# EAGLE design 555 (EAGLE 9.6.2)
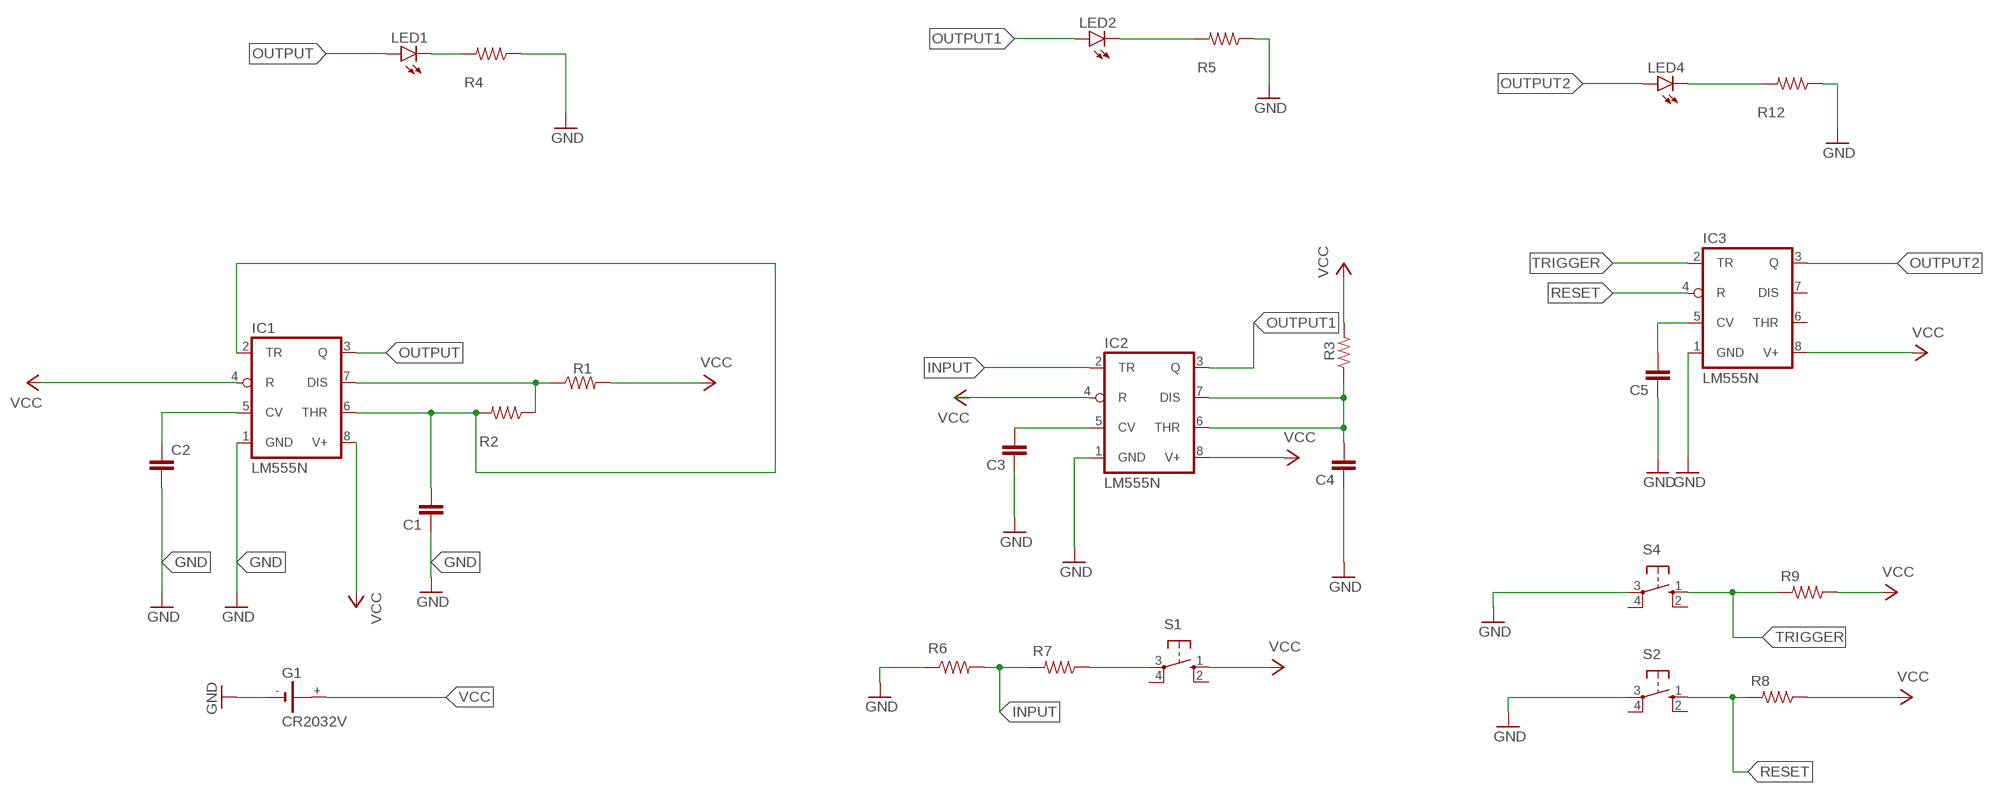
[diagram p0: schematic, sheet 1]

## Parts
C1  C-EU025-025X050  [C025-025X050]
C2  C-EU025-025X050  [C025-025X050]
C3  C-EU025-025X050  [C025-025X050]
C4  C-EU025-025X050  [C025-025X050]
C5  C-EU025-025X050  [C025-025X050]
G1  CR2032V  [CR2032V]
IC1  LM555N  [DIL08-ROUND]
IC2  LM555N  [DIL08-ROUND]
IC3  LM555N  [DIL08-ROUND]
LED1  LED3MM  [LED3MM]
LED2  LED3MM  [LED3MM]
LED4  LED3MM  [LED3MM]
R1  R-US_R2010  [R2010]
R2  R-US_R2010  [R2010]
R3  R-US_R2010  [R2010]
R4  R-US_R2010  [R2010]
R5  R-US_R2010  [R2010]
R6  R-US_R2010  [R2010]
R7  R-US_R2010  [R2010]
R8  R-US_R2010  [R2010]
R9  R-US_R2010  [R2010]
R12  R-US_R2010  [R2010]
S1  10-XX  [B3F-10XX]
S2  10-XX  [B3F-10XX]
S4  10-XX  [B3F-10XX]

## Nets
GND: C1.1 C2.2 C3.1 C4.1 C5.1 G1.- IC1.1(GND) IC2.1(GND) IC3.1(GND) R4.1 R5.1 R6.1 R12.1 S2.3(P) S4.3(P)
INPUT: IC2.2(TR) R6.2 R7.2
N$1: C2.1 IC1.5(CV)
N$2: C1.2 IC1.2(TR) IC1.6(THR) R2.2
N$3: C4.2 IC2.6(THR) IC2.7(DIS) R3.1
N$4: IC1.7(DIS) R1.1 R2.1
N$5: C3.2 IC2.5(CV)
N$6: LED2.K(C) R5.2
N$7: LED1.K(C) R4.2
N$9: R7.1 S1.3(P)
N$11: LED4.K(C) R12.2
N$12: C5.2 IC3.5(CV)
OUTPUT: IC1.3(Q) LED1.A
OUTPUT1: IC2.3(Q) LED2.A
OUTPUT2: IC3.3(Q) LED4.A
RESET: IC3.4(R) R8.2 S2.1(S)
TRIGGER: IC3.2(TR) R9.2 S4.1(S)
VCC: G1.+ IC1.4(R) IC1.8(V+) IC2.4(R) IC2.8(V+) IC3.8(V+) R1.2 R3.2 R8.1 R9.1 S1.1(S)
Unconnected: G1.+@1(+) IC3.6(THR) IC3.7(DIS) S1.2(S1) S1.4(P1) S2.2(S1) S2.4(P1) S4.2(S1) S4.4(P1)

## Library data of the parts
C1-C5 = rcl:C-EU: CAPACITOR, European symbol; SPICEPREFIX: C
G1 = battery:CR2032V: LI BATTERY Varta
IC1-IC3 = adafruit:*555: TIMER Changed DIP package to have round (not oval) pin pads http://www.ladyada.net/library/pcb/eaglelibrary.html
LED1 LED2 LED4 = led:LED: LED OSRAM: - CHIPLED LG R971, LG N971, LY N971, LG Q971, LY Q971, LO R971, LY R971 LH N974, LH R974 LS Q976, LO Q976, LY Q976 LO Q996 - Hyper CHIPLED LW Q18S LB Q993, LB Q99A, LB R99A - SideLED LS A670, LO A670, LY A670, LG A670, LP A670 LB A673, LV A673, LT A673, LW A673 LH A674 LY A675 LS A676, LA A676, LO A676, LY A676, LW A676 LS A679, LY A679, LG A679 - Hyper Micro SIDELED® LS Y876, LA Y876, LO Y876, LY Y876 LT Y87S - SmartLED LW L88C, LW L88S LB L89C, LB L89S, LG L890 LS L89K, LO L89K, LY L89K LS L896, LA L896, LO L896, LY L896 - TOPLED LS T670, LO T670, LY T670, LG T670, LP T670 LSG T670, LSP T670, LSY T670, LOP T670, LYG T670 LG T671, LOG T671, LSG T671 LB T673, LV T673, LT T673, LW T673 LH T674 LS T676, LA T676, LO T676, LY T676, LB T676, LH T676, LSB T676, LW T676 LB T67C, LV T67C, LT T67C, LS T67K, LO T67K, LY T67K, LW E67C LS E67B, LA E67B, LO E67B, LY E67B, LB E67C, LV E67C, LT E67C LW T67C LS T679, LY T679, LG T679 LS T770, LO T770, LY T770, LG T770, LP T770 LB T773, LV T773, LT T773, LW T773 LH T774 LS E675, LA E675, LY E675, LS T675 LS T776, LA T776, LO T776, LY T776, LB T776 LHGB T686 LT T68C, LB T68C - Hyper Mini TOPLED® LB M676 - Mini TOPLED Santana® LG M470 LS M47K, LO M47K, LY M47K Source: http://www.osram.convergy.de LUXEON: - LUMILED® LXK2-PW12-R00, LXK2-PW12-S00, LXK2-PW14-U00, LXK2-PW14-V00 LXK2-PM12-R00, LXK2-PM12-S00, LXK2-PM14-U00 LXK2-PE12-Q00, LXK2-PE12-R00, LXK2-PE12-S00, LXK2-PE14-T00, LXK2-PE14-U00 LXK2-PB12-K00, LXK2-PB12-L00, LXK2-PB12-M00, LXK2-PB14-N00, LXK2-PB14-P00, LXK2-PB14-Q00 LXK2-PR12-L00, LXK2-PR12-M00, LXK2-PR14-Q00, LXK2-PR14-R00 LXK2-PD12-Q00, LXK2-PD12-R00, LXK2-PD12-S00 LXK2-PH12-R00, LXK2-PH12-S00 LXK2-PL12-P00, LXK2-PL12-Q00, LXK2-PL12-R00 Source: www.luxeon.com KINGBRIGHT: KA-3528ASYC Source: www.kingbright.com
R1-R9 R12 = adafruit:R-US_: RESISTOR, American symbol
S1 S2 S4 = switch-omron:10-XX: OMRON SWITCH; MPN: B3F-1000; OC_FARNELL: 176432; OC_NEWARK: 36M3542

## Board
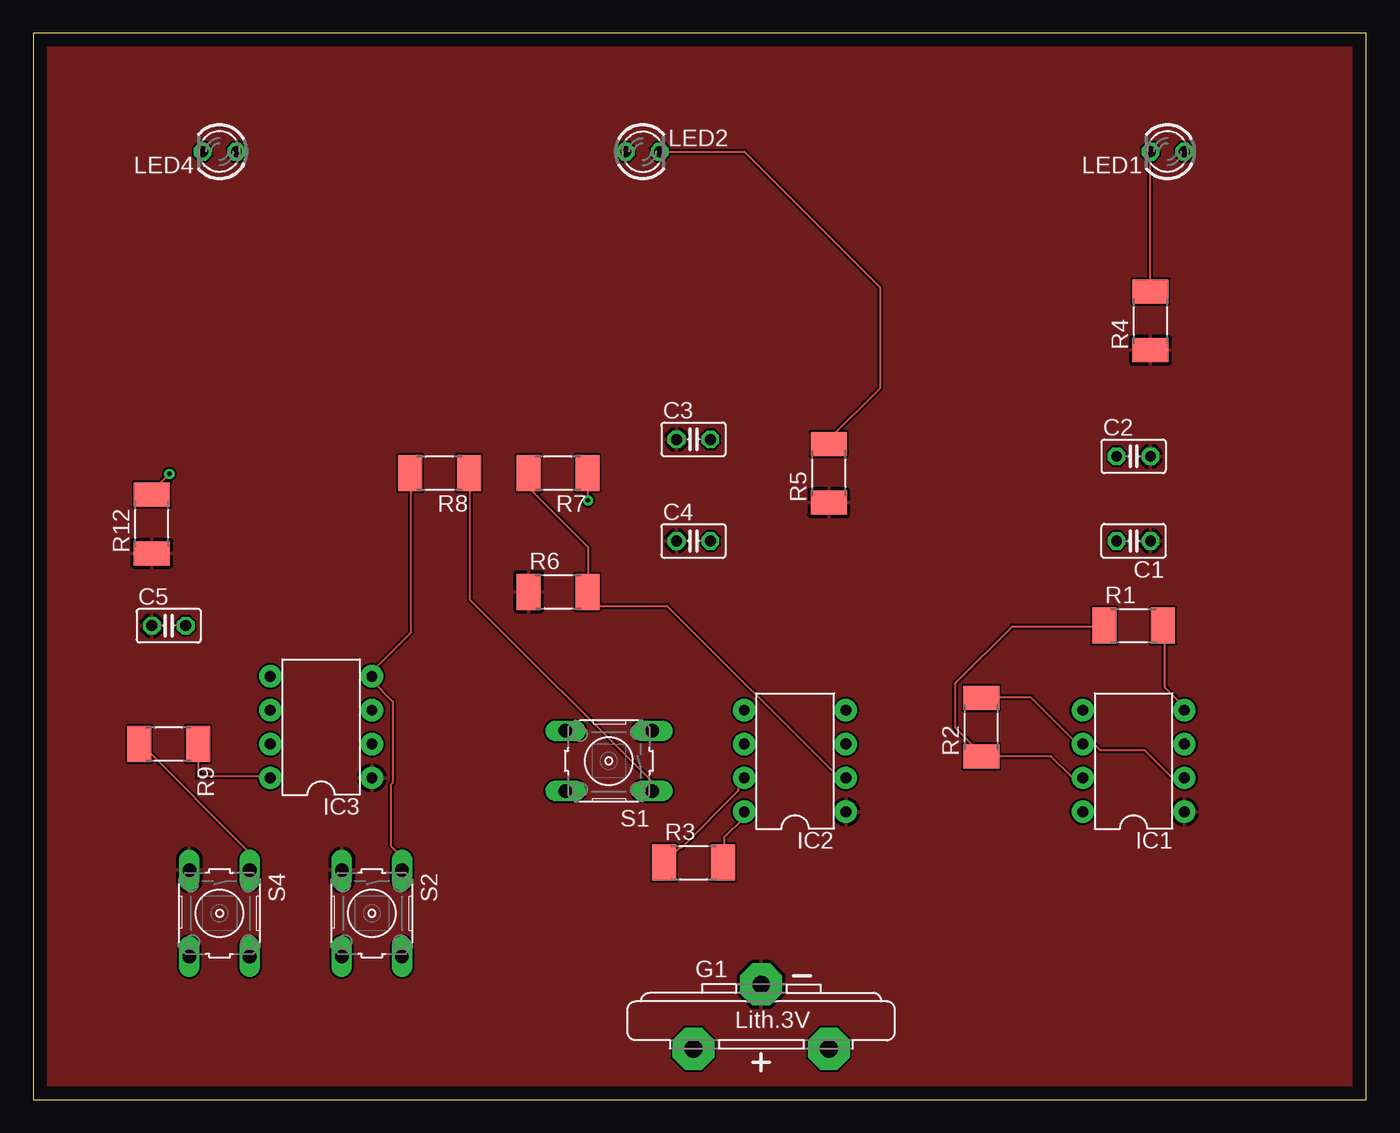
[diagram p1: board, top side]
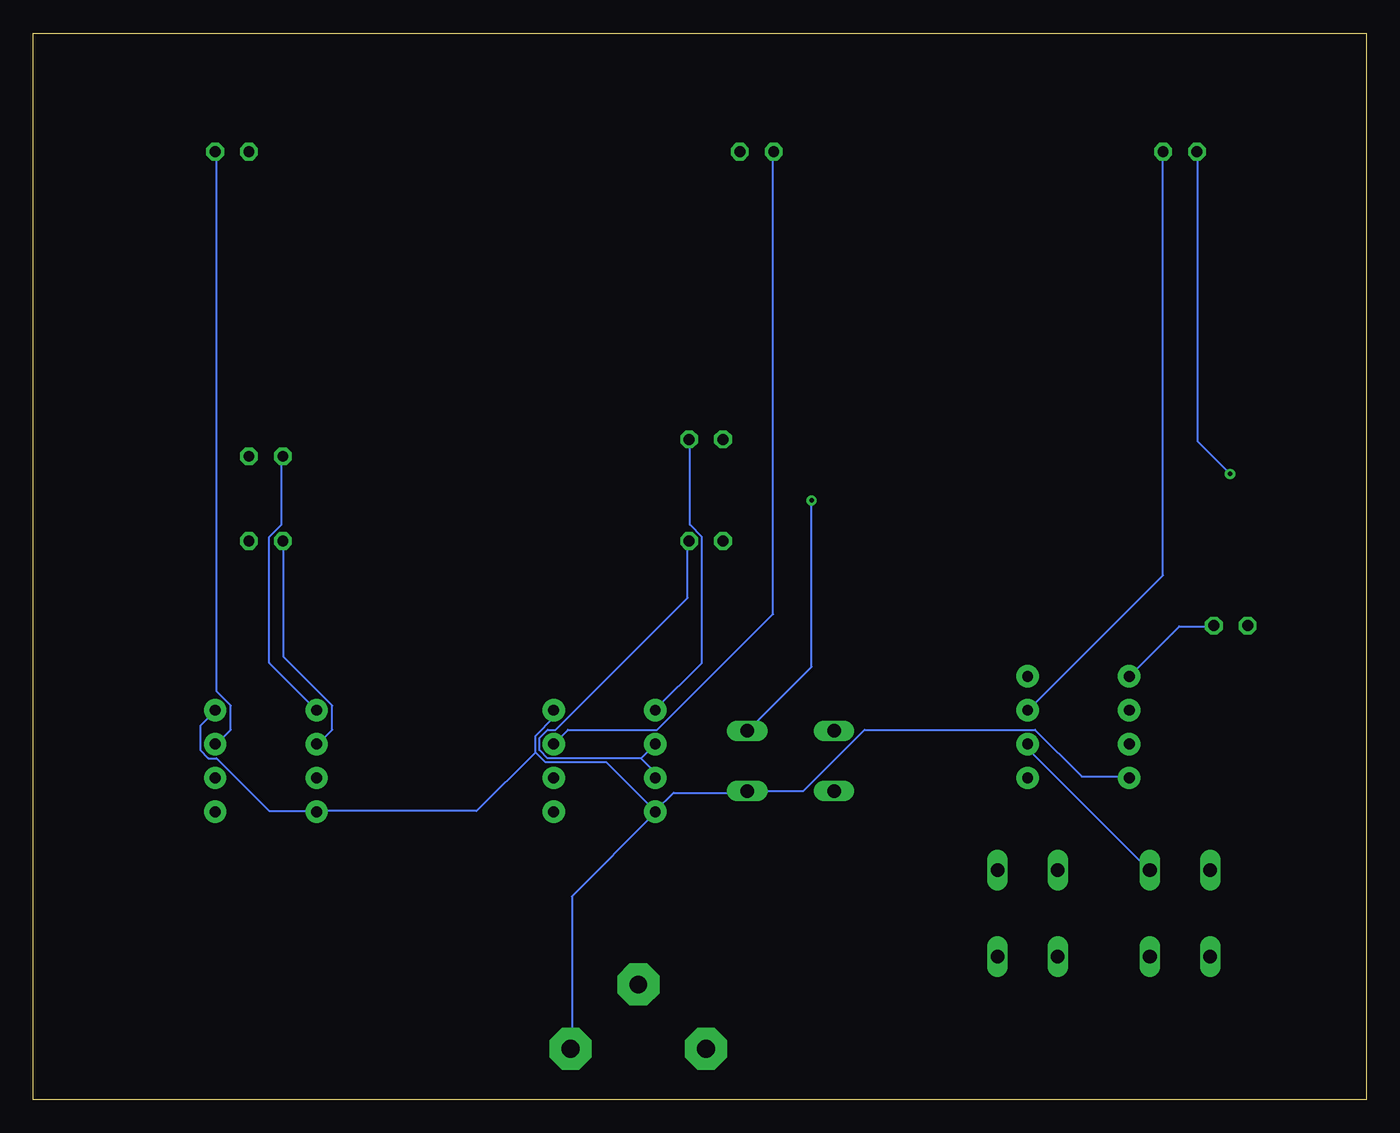
[diagram p2: board, bottom side, seen from below]

Size 100 x 80 mm. Coordinates in mm from the lower left corner, seen from the top.
Outline: 0,0 100,0 100,80 0,80 0,0
Copper layers (1*16): Top 0.035mm / dielectric 1.5mm / Bottom 0.035mm
Design rules "default": minimum track width 6mil, minimum drill 0.35mm, track to track 6mil, track to pad 6mil, pad to pad 6mil, via to via 6mil, smd to smd 6mil, copper to edge 40mil, drill to drill 6mil, minimum pad ring 10mil, minimum via ring 8mil, stop-mask expansion 4mil, vias tented up to drill 0mil, thermal gap 10mil

### Footprints (pad centres in the part's own frame; a part is rotated, then mirrored left to right if it is on the bottom)
C025-025X050 = drill 0.813 octagon: 1 -1.27,0; 2 1.27,0
CR2032V = drill 1.321 pad 3.15 octagon: + -2.54,-5.08; +@1 -2.54,5.08; - 2.286,0
DIL08-ROUND = drill 0.813 pad 1.676: 1 -3.81,-3.81; 2 -1.27,-3.81; 3 1.27,-3.81; 4 3.81,-3.81; 5 3.81,3.81; 6 1.27,3.81; 7 -1.27,3.81; 8 -3.81,3.81
LED3MM = drill 0.813 octagon: A -1.27,0; K 1.27,0
R2010 = smd 1.8 x 2.7: 1 -2.2,0; 2 2.2,0
B3F-10XX = drill 1.016 long: 1 -3.251,2.261; 2 3.251,2.261; 3 -3.251,-2.261; 4 3.251,-2.261

### Placement (x,y rotation side)
C1  82.55,41.91 180 top
C2  82.55,48.26 0 top
C3  49.53,49.53 0 top
C4  49.53,41.91 0 top
C5  10.16,35.56 0 top
G1  54.61,6.35 90 top
IC1  82.55,25.4 90 top
IC2  57.15,25.4 90 top
IC3  21.59,27.94 90 top
LED1  85.09,71.12 180 top
LED2  45.72,71.12 0 top
LED4  13.97,71.12 180 top
R1  82.55,35.56 0 top
R2  71.12,27.94 90 top
R3  49.53,17.78 0 top
R4  83.82,58.42 90 top
R5  59.69,46.99 90 top
R6  39.37,38.1 0 top
R7  39.37,46.99 180 top
R8  30.48,46.99 180 top
R9  10.16,26.67 180 top
R12  8.89,43.18 90 top
S1  43.18,25.4 180 top
S2  25.4,13.97 270 top
S4  13.97,13.97 270 top

### Tracks (layer width: path | path; a pad name or v marks a point on that pad's centre or on a via)
GND
  pour Top: -2.54,82.55 104.14,82.55 105.41,83.82 105.41,-2.54 102.87,-5.08 24.13,-5.08 -5.08,-5.08 -6.35,-3.81 -6.35,80.01 -3.81,82.55
INPUT
  Top 0.152: R7.2 37.19,46.94 37.19,45.87 41.6,41.45 41.6,38.1 R6.2 41.45,38.1 42.52,37.03 47.55,37.03 60.35,24.23 60.96,24.23 IC2.2
N$1
  Bottom 0.152: IC1.5 82.3,32.77 82.3,42.22 81.38,43.13 81.38,48.16 C2.1
N$2
  Top 0.152: R2.2 71.17,30.18 74.83,30.18 78.33,26.67 IC1.6 79.55,26.67 80.01,26.21 83.36,26.21 85.34,24.23 86.26,24.23 IC1.2
  Bottom 0.152: C1.2 81.23,41.91 81.23,33.22 77.57,29.57 77.57,27.74 78.64,26.67 IC1.6
N$3
  Top 0.152: IC2.7 53.34,23.77 52.88,23.32 52.88,23.16 48.62,18.9 48.46,18.9 47.4,17.83 R3.1
  Bottom 0.152: 54.41,25.6 61.42,25.6 62.03,26.21 62.03,27.13 61.42,27.74 60.81,27.74 50.9,37.64 50.9,41.91 C4.2 | IC2.6 54.41,25.6 | IC2.7 53.34,24.54 54.41,25.6
N$4
  Top 0.152: 71.32,25.76 76.35,25.76 77.88,24.23 78.64,24.23 IC1.7 | 71.32,25.76 71.17,25.76 R2.1 71.32,25.76 | 71.32,25.76 69.19,27.89 69.19,31.24 73.46,35.51 80.31,35.51 R1.1
N$5
  Bottom 0.152: C3.2 50.75,49.53 50.75,43.13 49.84,42.22 49.84,32.77 53.34,29.26 IC2.5
N$6
  Top 0.152: R5.2 59.59,49.23 59.49,49.33 63.5,53.34 63.5,60.96 53.34,71.12 LED2.K
N$7
  Top 0.152: R4.2 LED1.K
N$9  (via drill 0.35)
  Top 0.152: v41.6,44.96 41.6,46.94 R7.1
  Bottom 0.152: v41.6,44.96 41.6,32.46 46.33,27.74 S1.3
N$11  (via drill 0.35)
  Top 0.152: v10.21,46.94 8.99,45.72 8.99,45.41 R12.2
  Bottom 0.152: v10.21,46.94 12.65,49.38 12.65,71.02 LED4.K
N$12
  Bottom 0.152: IC3.5 14.02,35.51 11.43,35.51 C5.2
OUTPUT
  Bottom 0.152: LED1.A 86.26,71.02 86.26,30.63 85.19,29.57 85.19,27.74 86.26,26.67 IC1.3
OUTPUT1
  Bottom 0.152: IC2.3 59.89,27.74 53.19,27.74 44.5,36.42 44.5,71.02 LED2.A
OUTPUT2
  Bottom 0.152: LED4.A 15.24,39.32 25.3,29.26 IC3.3
RESET
  Top 0.152: R8.2 28.35,46.94 28.35,35.05 25.45,32.16 25.45,31.85 IC3.4 25.45,31.7 25.45,31.39 26.98,29.87 26.98,23.77 26.82,23.62 26.82,19.05 27.58,18.29 27.58,17.22 S2.1
TRIGGER
  Top 0.152: R9.2 8.08,26.67 16.15,18.59 16.15,17.22 S4.1
  Bottom 0.152: IC3.2 25.3,26.67 25.3,26.21 16.31,17.22 S4.1
VCC
  Top 0.152: R9.1 12.36,24.23 17.68,24.23 IC3.8 | R8.1 32.77,46.94 32.77,37.49 46.33,23.93 46.33,23.16 S1.1 | R1.2 84.89,35.51 84.89,30.94 86.26,29.57 86.26,29.26 IC1.4 | IC2.8 53.34,21.18 51.82,19.66 51.82,17.83 R3.2
  Bottom 0.152: IC3.8 17.83,24.23 21.34,24.23 24.84,27.74 37.64,27.74 42.22,23.16 46.33,23.16 S1.1 46.48,23.01 51.97,23.01 53.34,21.64 | IC1.4 86.41,29.11 87.48,28.04 87.48,26.21 86.87,25.6 86.26,25.6 82.3,21.64 78.79,21.64 IC1.8 78.64,21.64 66.75,21.64 62.33,26.06 | IC2.4 60.96,28.65 62.33,27.28 62.33,26.06 | 62.33,26.06 61.57,25.3 57,25.3 53.34,21.64 | G1.+ 59.59,3.81 59.59,15.24 53.34,21.49 IC2.8 53.34,21.64